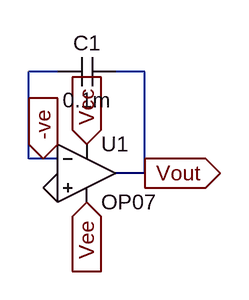
[diagram p0: schematic Integrator.asc]
Integrator.asc, the LTspice schematic file:
Version 4
SHEET 1 880 680
WIRE 80 96 48 96
WIRE 176 96 144 96
WIRE 48 192 48 96
WIRE 64 192 48 192
WIRE 80 192 64 192
WIRE 176 208 176 96
WIRE 176 208 144 208
FLAG 64 192 -ve
IOPIN 64 192 In
FLAG 80 224 0
FLAG 176 208 Vout
IOPIN 176 208 Out
FLAG 112 176 Vcc
IOPIN 112 176 In
FLAG 112 240 Vee
IOPIN 112 240 In
SYMBOL cap 144 80 R90
WINDOW 0 0 32 VBottom 2
WINDOW 3 32 32 VTop 2
SYMATTR InstName C1
SYMATTR Value 0.1m
SYMBOL OpAmps\\OP07 112 144 R0
SYMATTR InstName U1

The netlist it stands for:
* Integrator.asc
C1 Vout -ve 0.1m
XU1 0 -ve Vcc Vee Vout LT1001  ; OP07, pins In+ In- V+ V- OUT
.lib LTC.lib
.backanno
.end